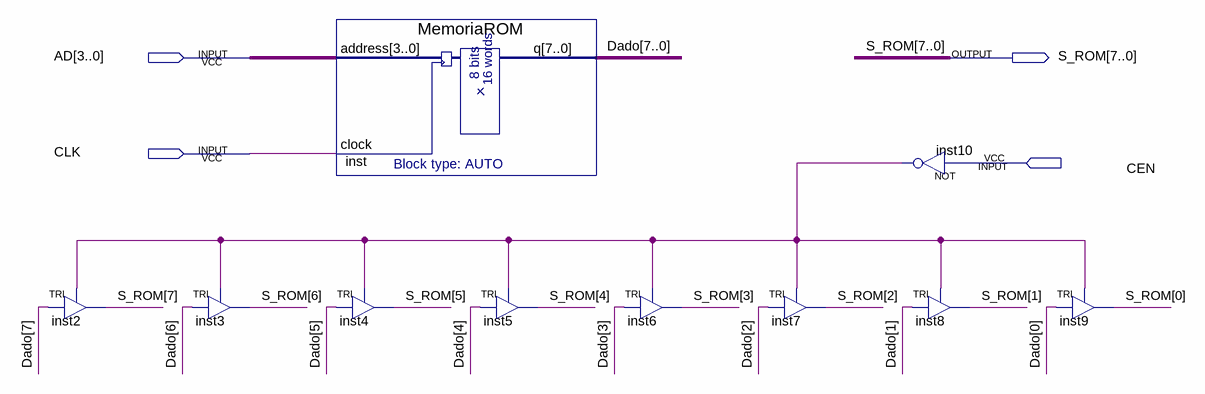
[diagram p0: schematic sheet]
// Quartus schematic Memoria_ROM.bdf as structural Verilog: 10 symbols, 4 pins
module Memoria_ROM (
  input  [3:0] AD,
  input  CLK,
  input  CEN,
  output [7:0] S_ROM
);

  wire inst10_out;
  wire [7:0] Dado;

  TRI inst2 (.IN(Dado[7]), .OE(inst10_out), .OUT(S_ROM[7]));
  TRI inst3 (.IN(Dado[6]), .OE(inst10_out), .OUT(S_ROM[6]));
  MemoriaROM inst (.address(AD), .clock(CLK), .q(Dado));
  TRI inst4 (.IN(Dado[5]), .OE(inst10_out), .OUT(S_ROM[5]));
  TRI inst5 (.IN(Dado[4]), .OE(inst10_out), .OUT(S_ROM[4]));
  TRI inst6 (.IN(Dado[3]), .OE(inst10_out), .OUT(S_ROM[3]));
  TRI inst7 (.IN(Dado[2]), .OE(inst10_out), .OUT(S_ROM[2]));
  not inst10 (inst10_out, CEN);
  TRI inst8 (.IN(Dado[1]), .OE(inst10_out), .OUT(S_ROM[1]));
  TRI inst9 (.IN(Dado[0]), .OE(inst10_out), .OUT(S_ROM[0]));
endmodule
